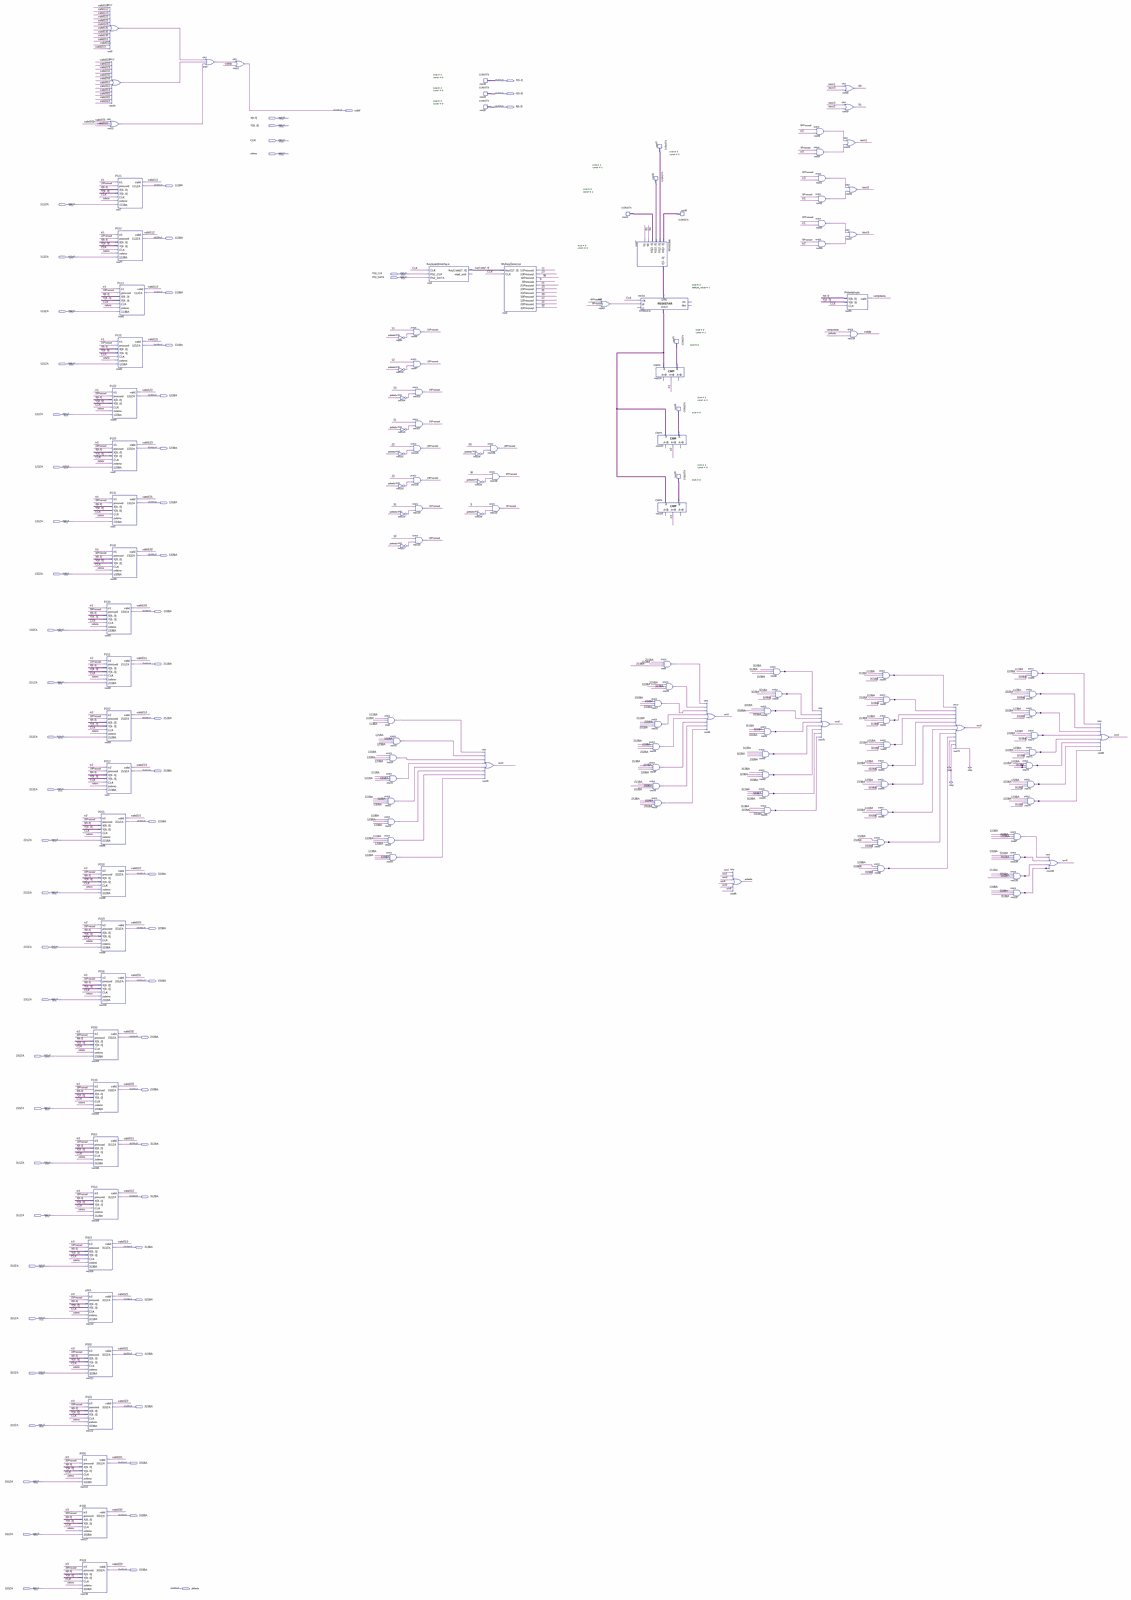
[diagram p0: schematic sheet, whole]
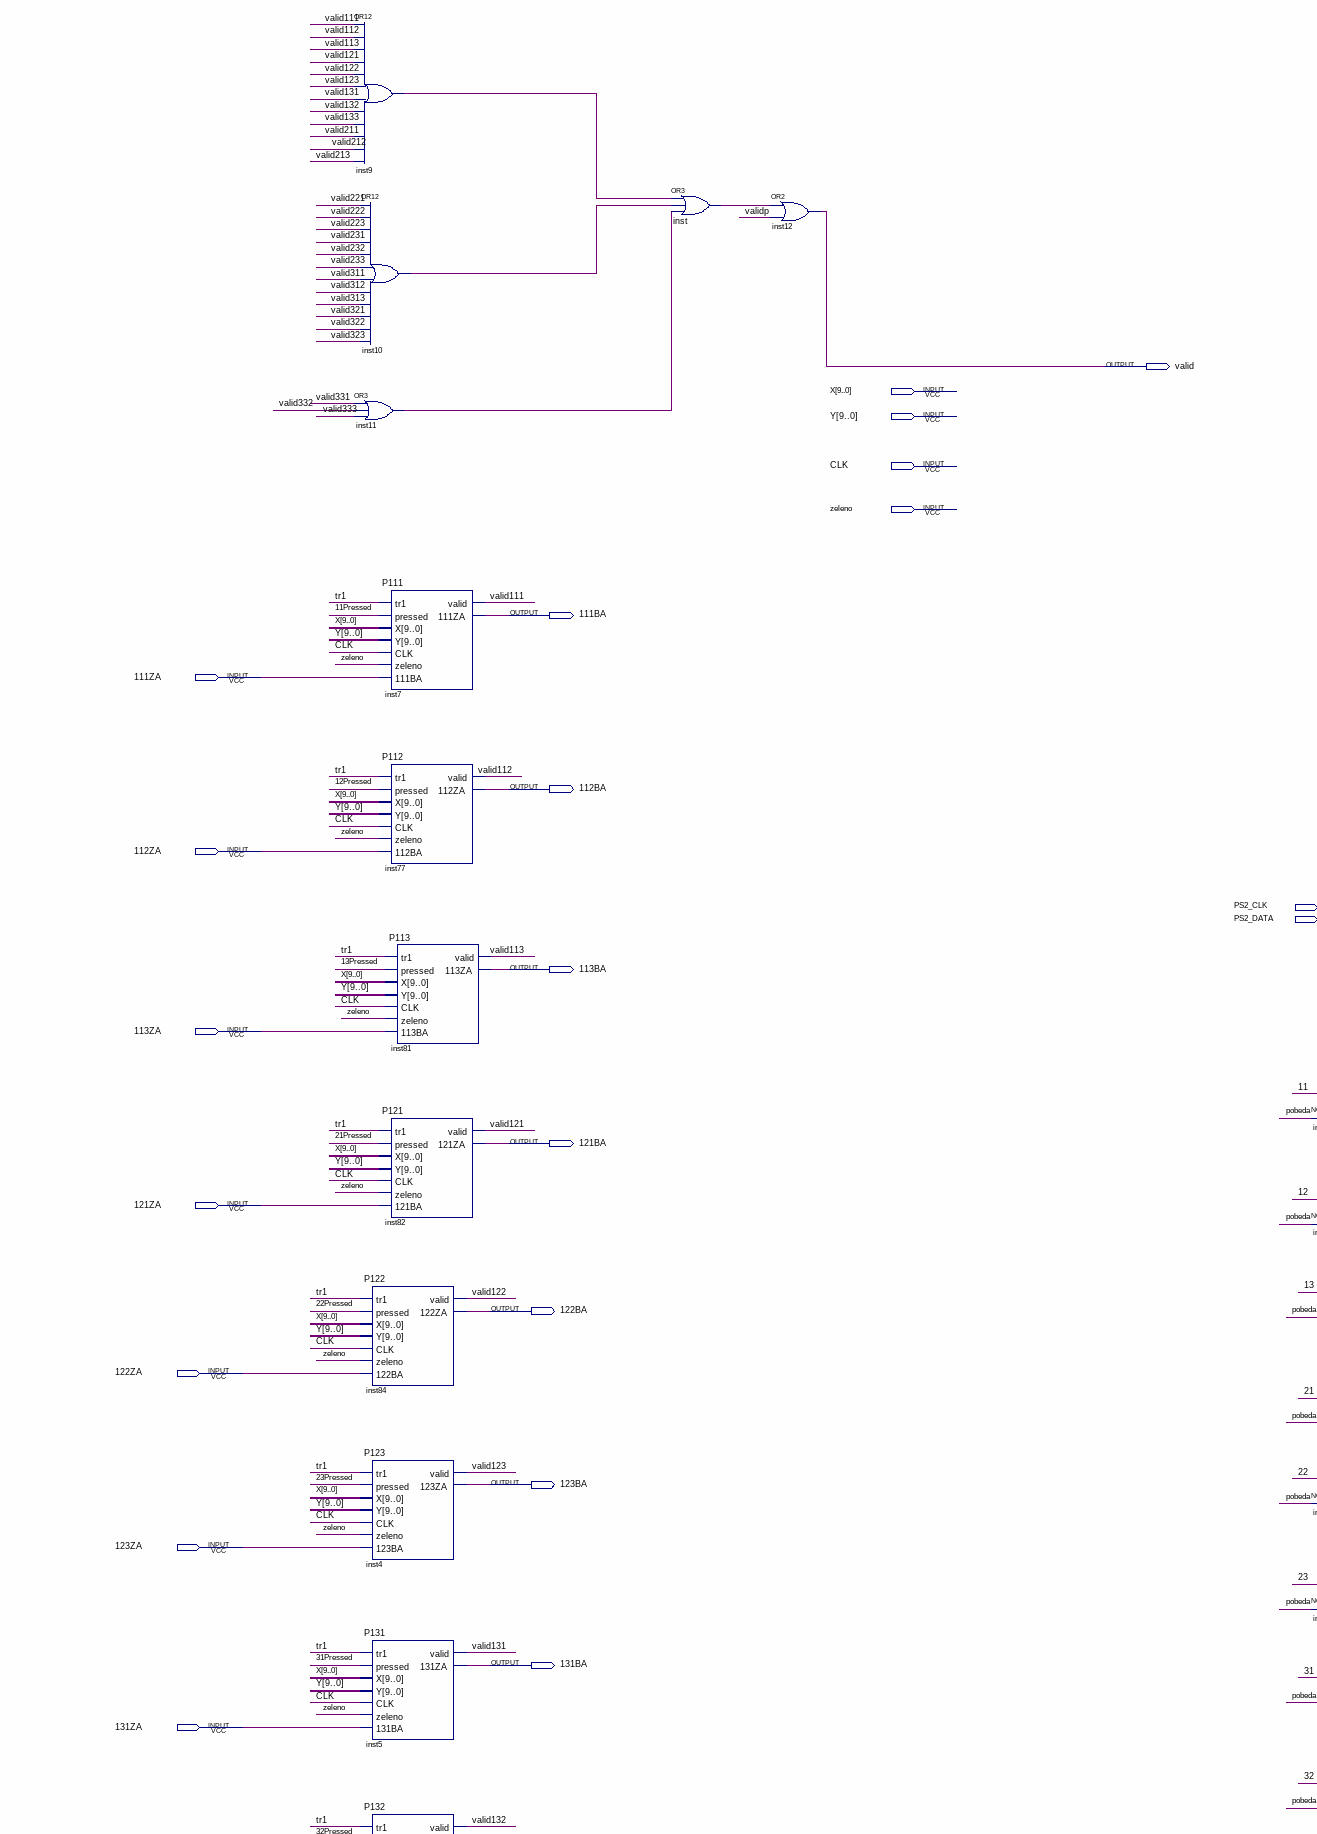
[diagram p1: schematic sheet, upper left part]
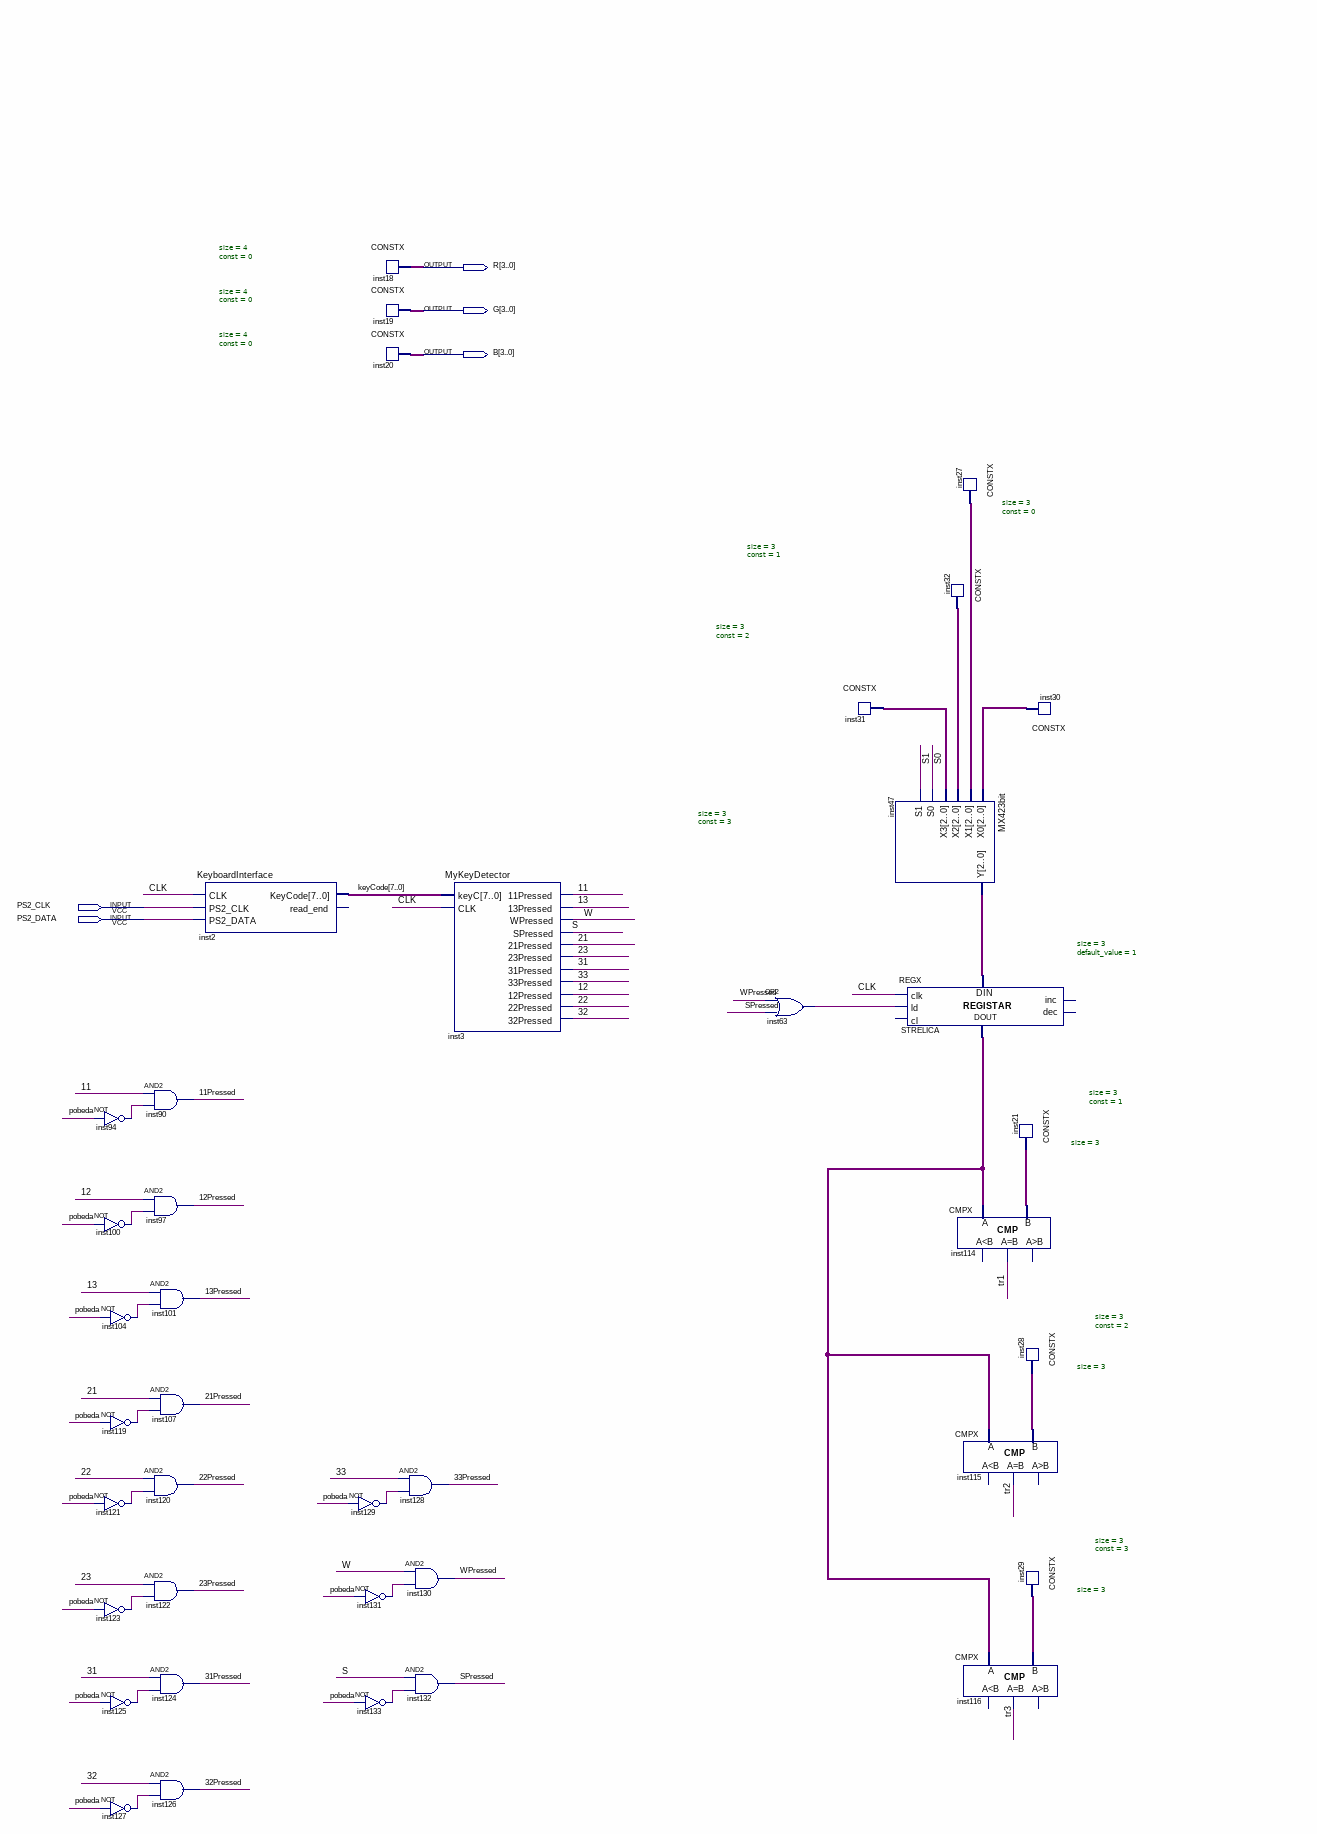
[diagram p2: schematic sheet, upper centre part]
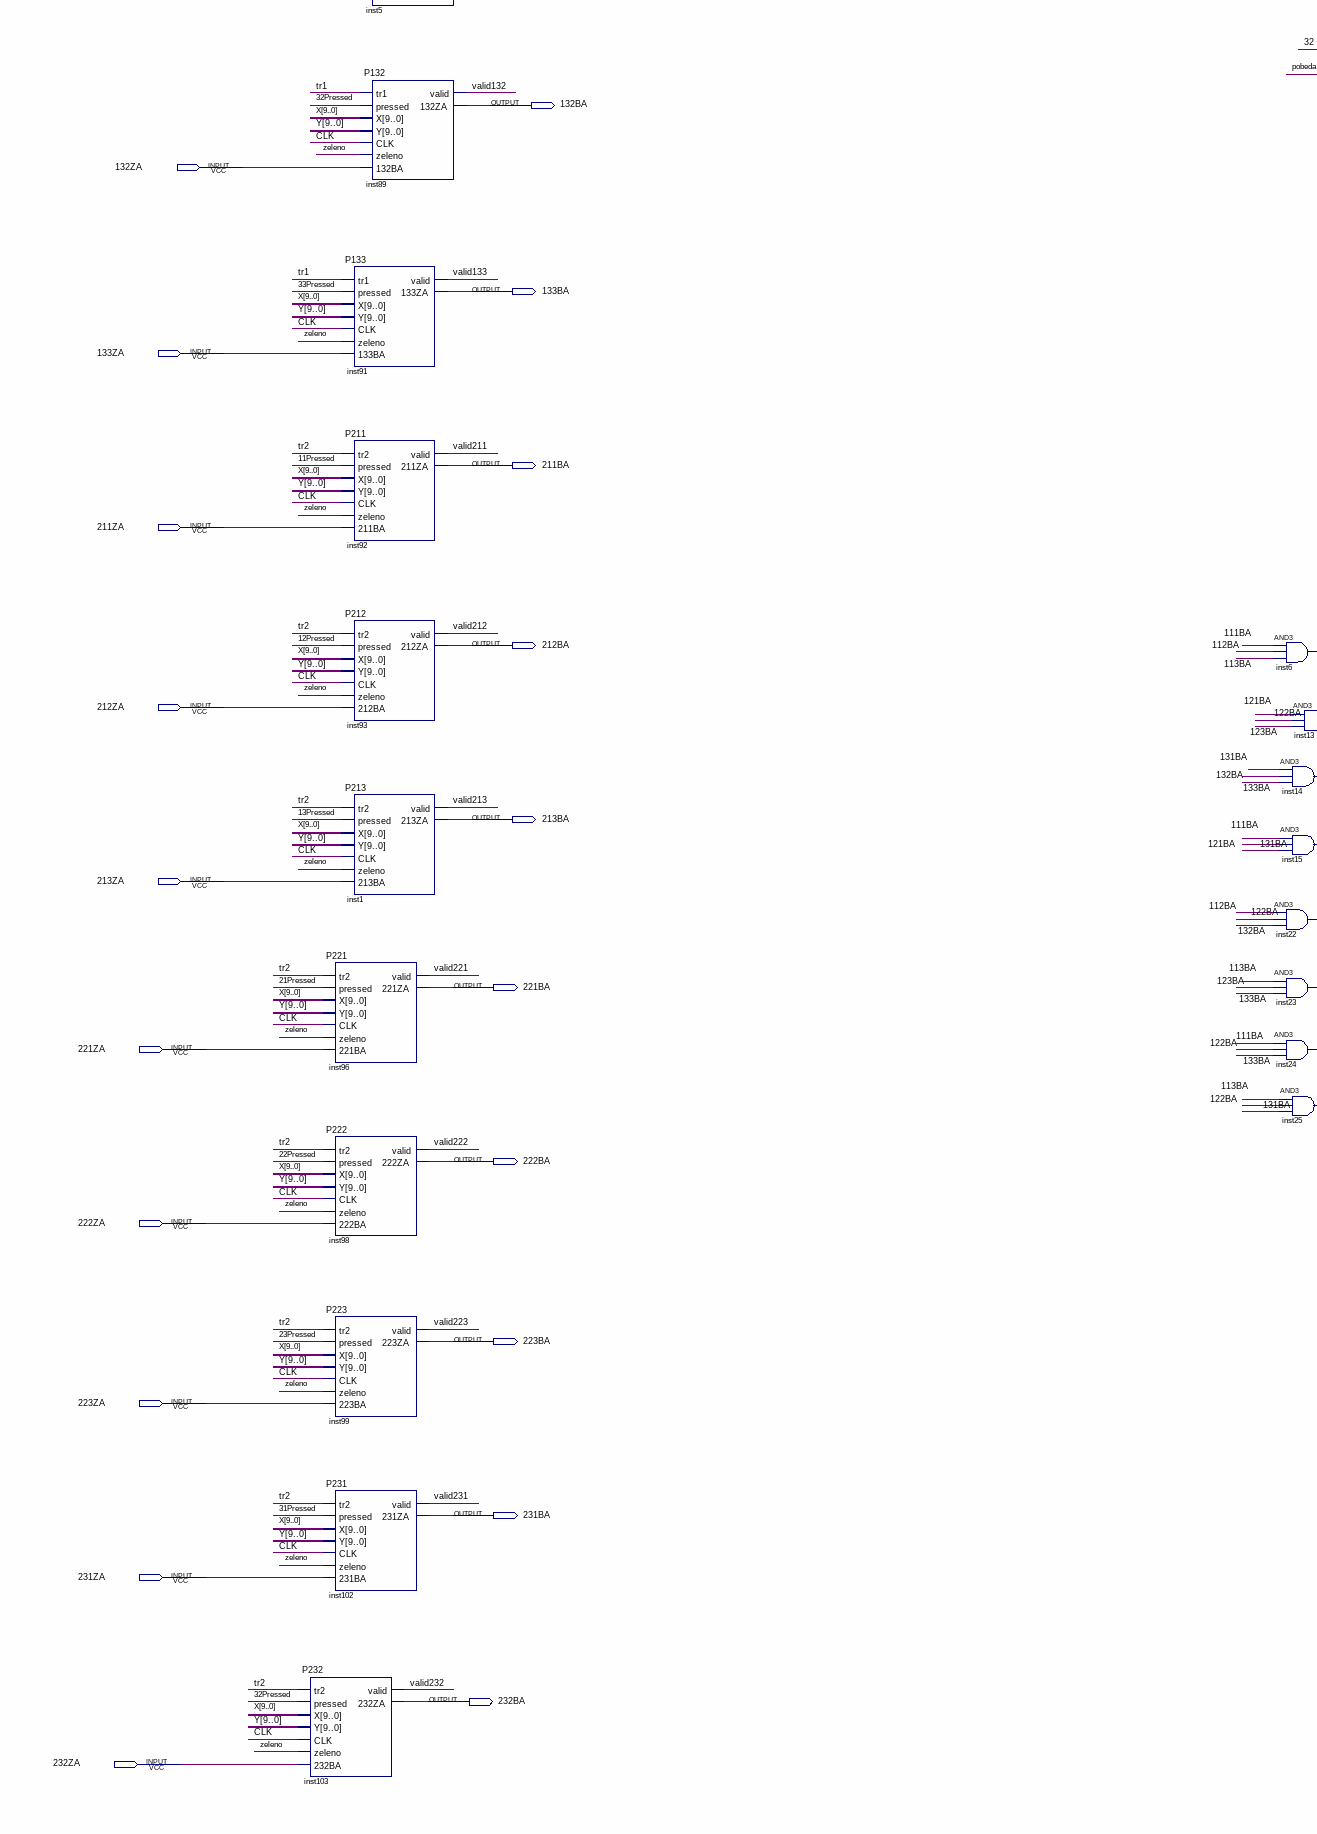
[diagram p3: schematic sheet, middle left part]
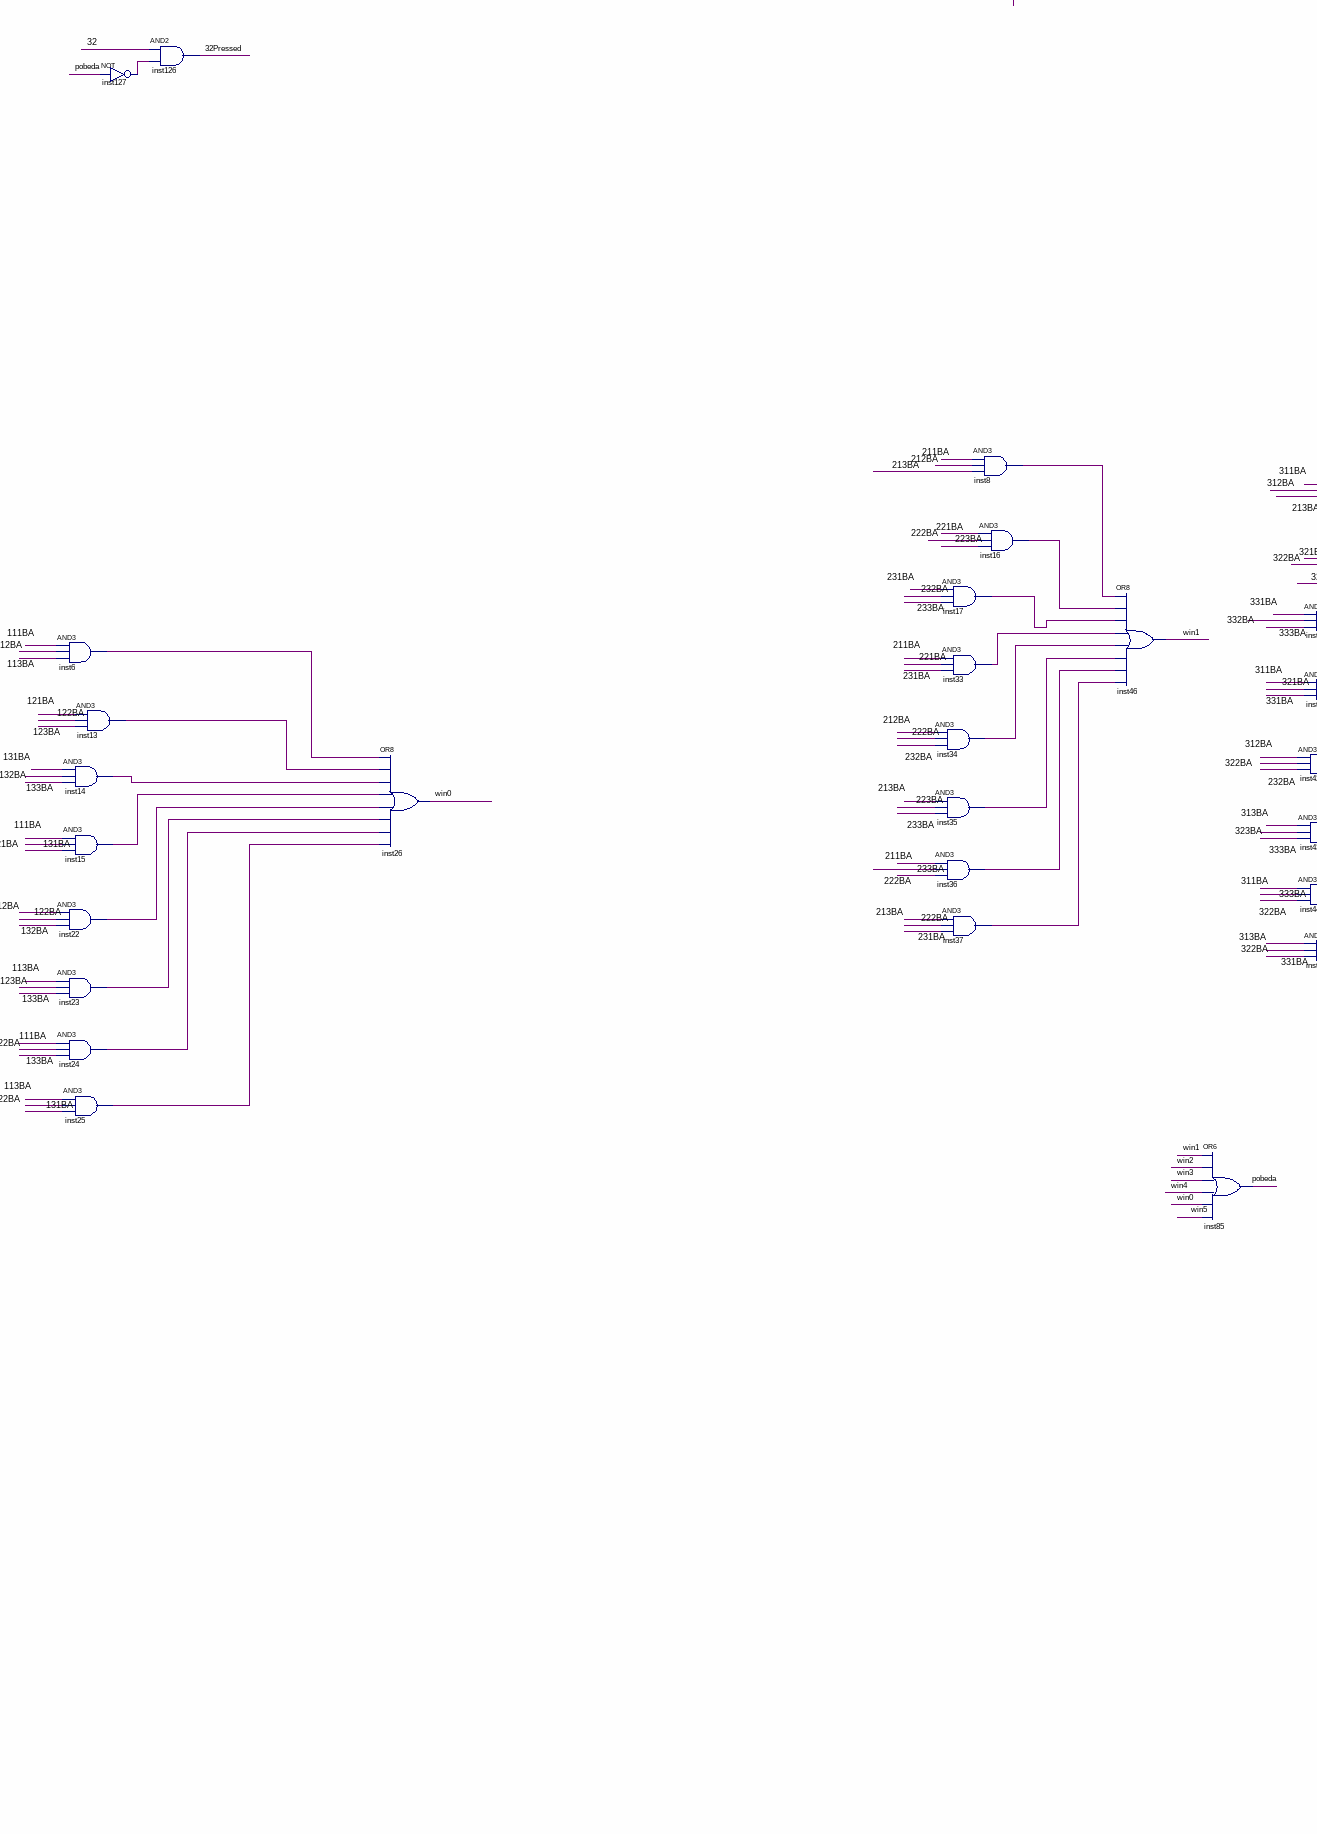
[diagram p4: schematic sheet, middle centre part]
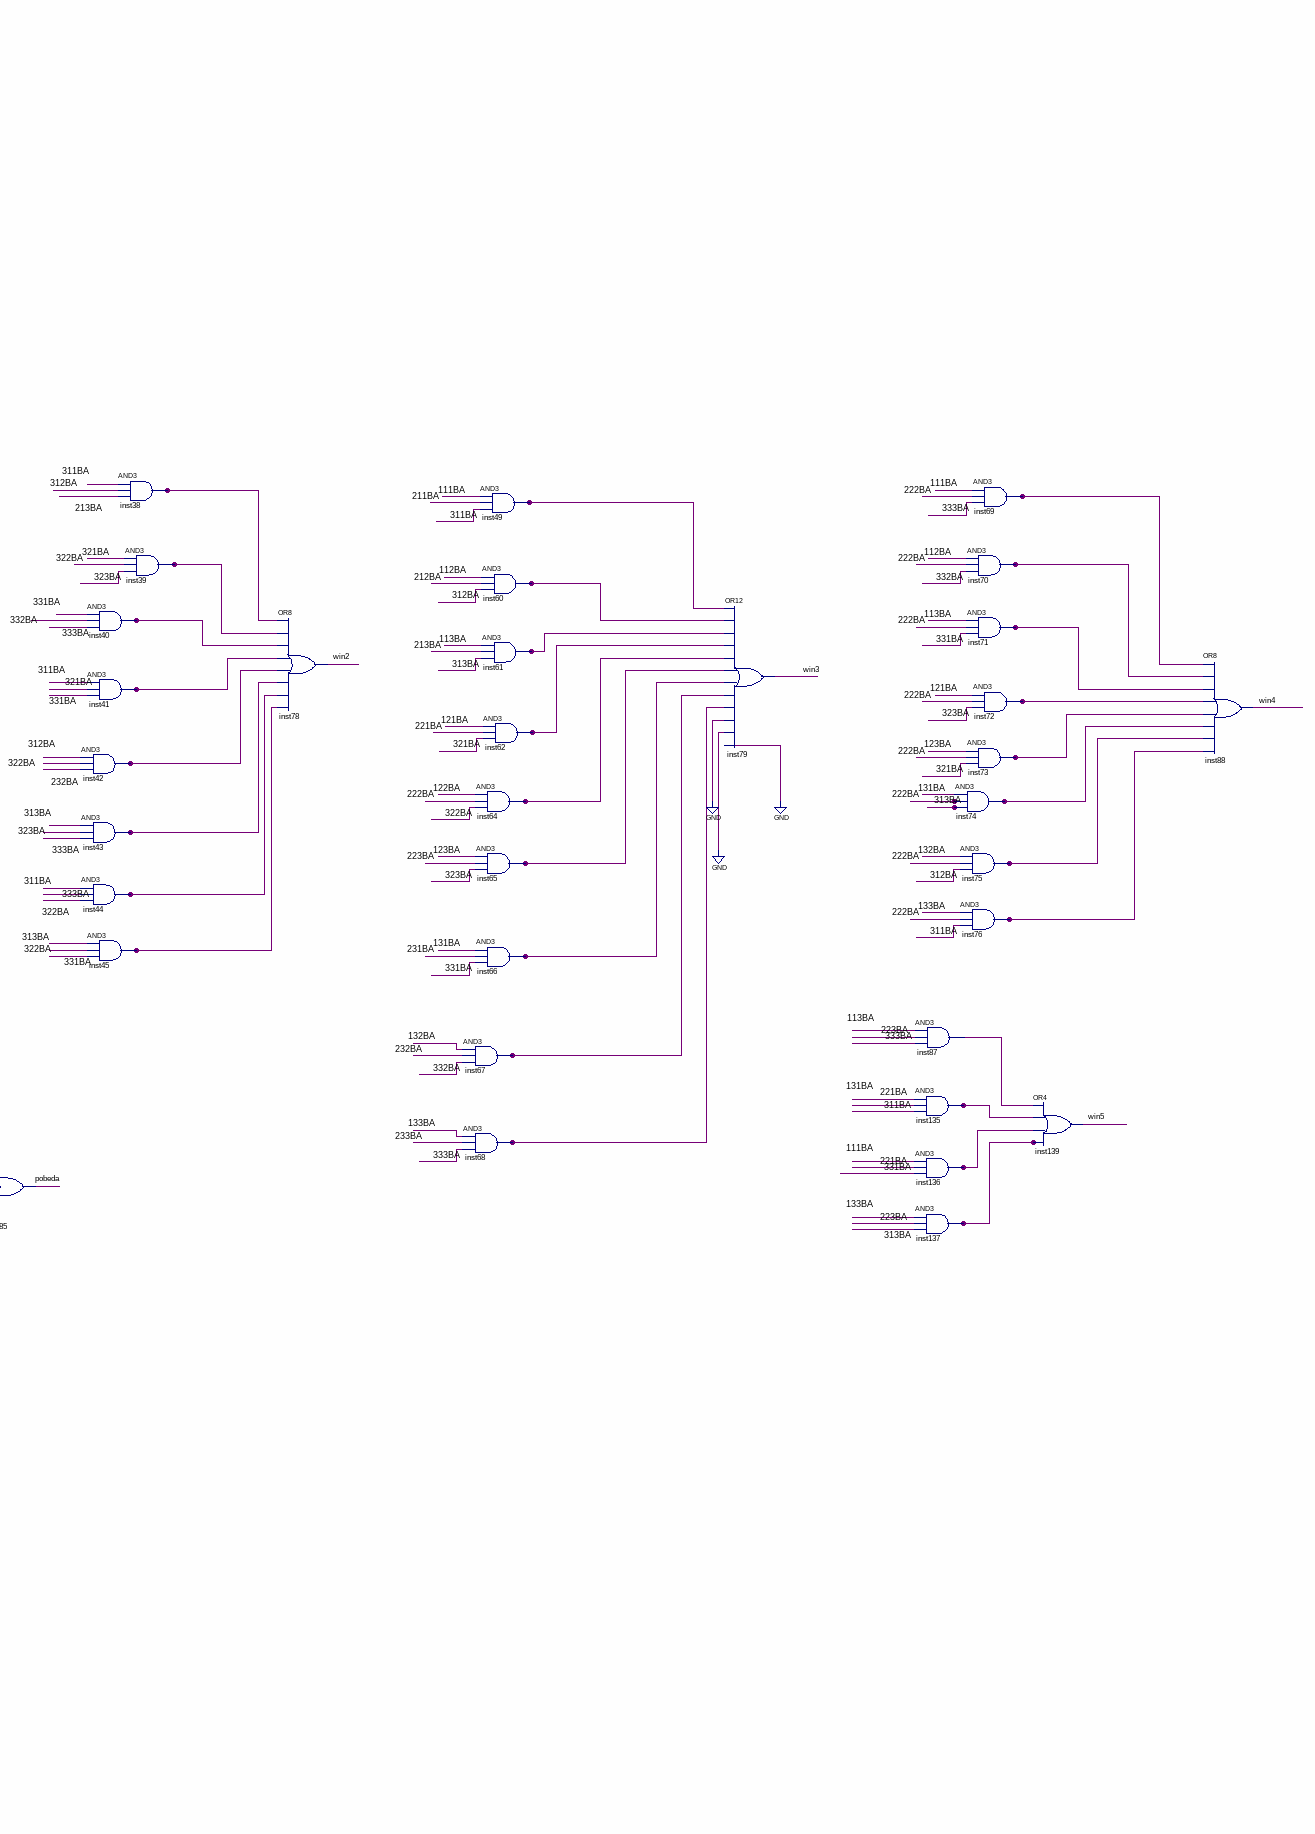
[diagram p5: schematic sheet, middle right part]
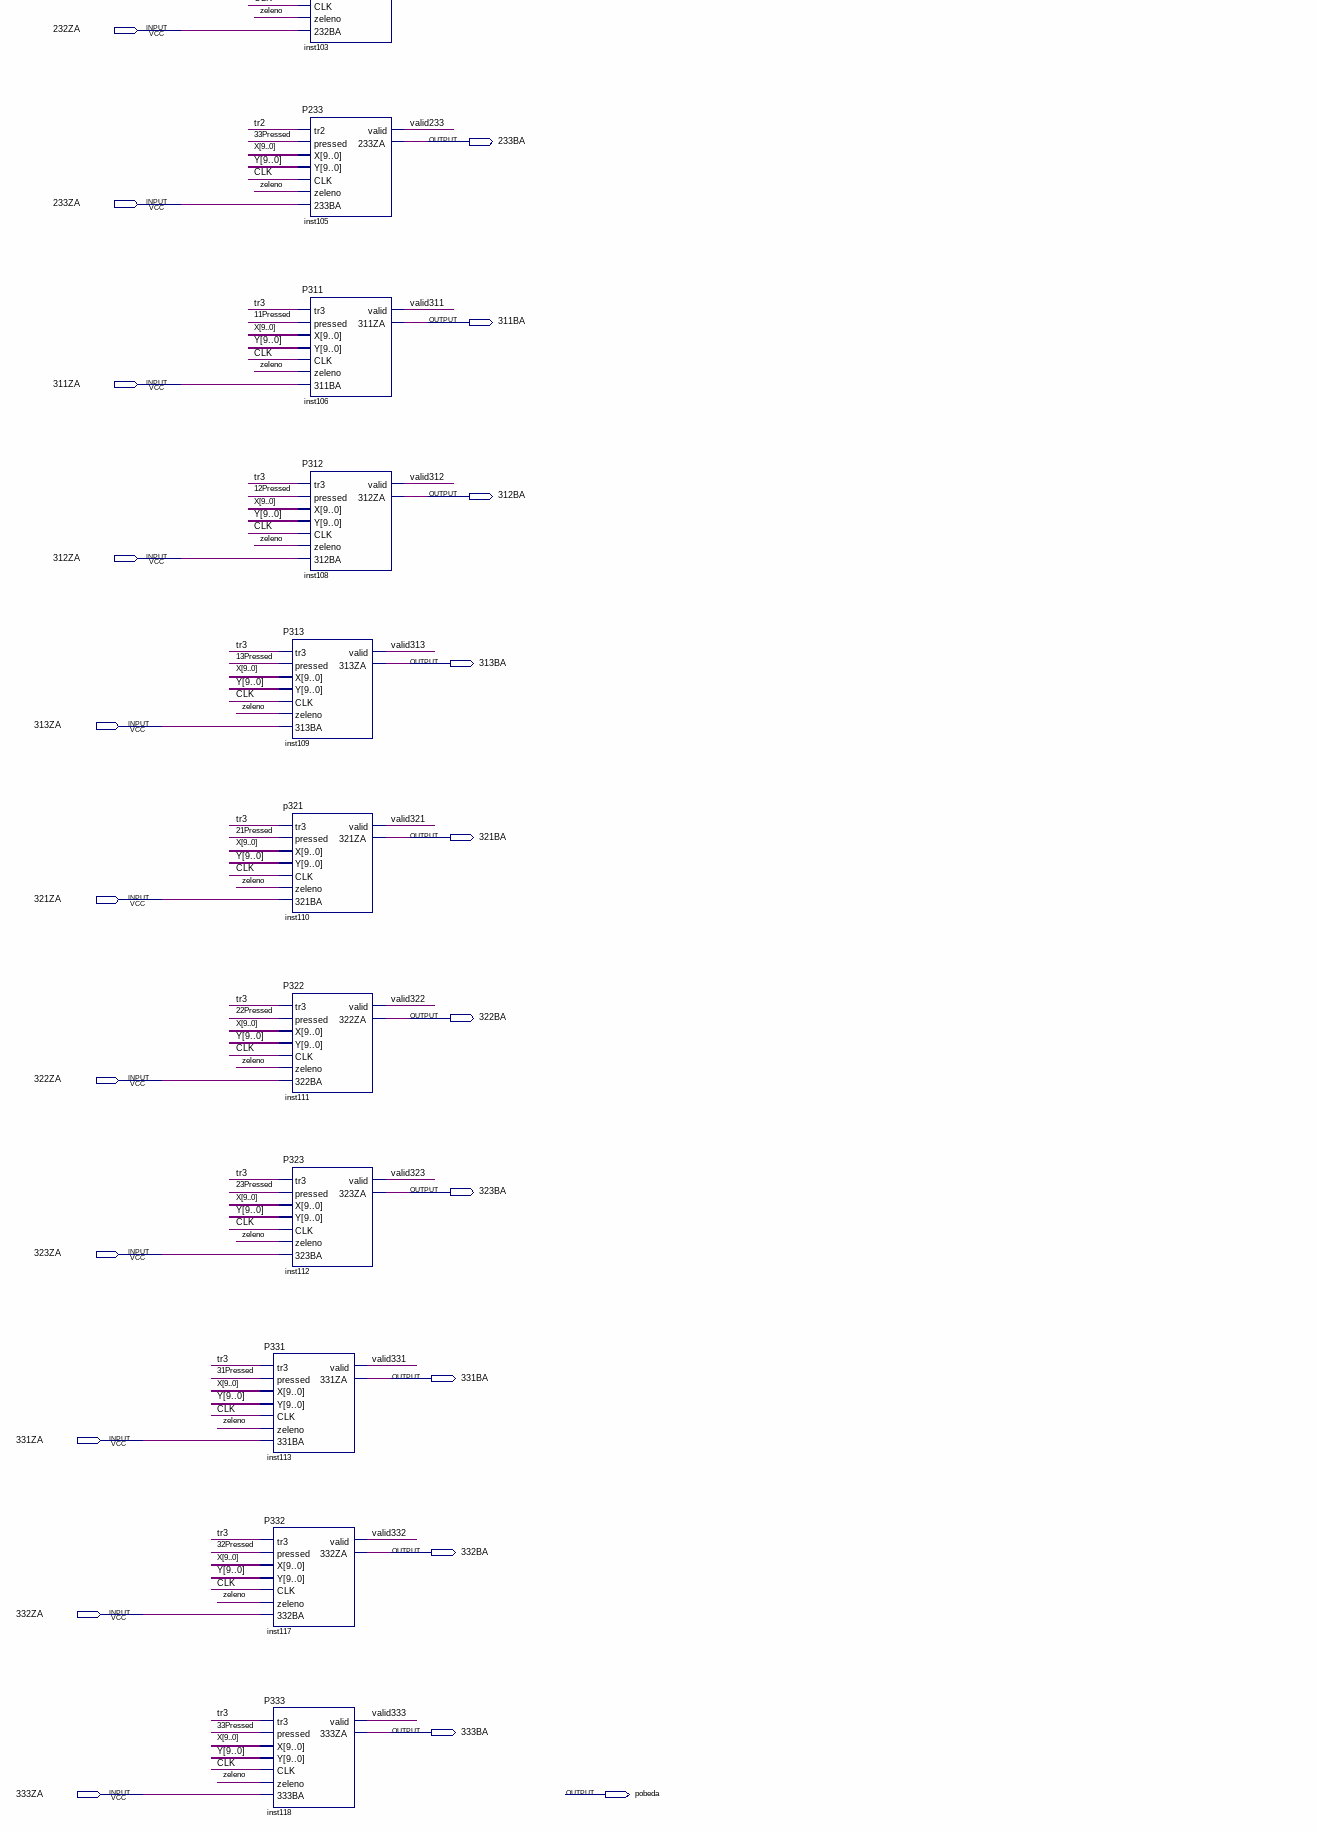
[diagram p6: schematic sheet, lower left part]
// Quartus schematic Layer3.bdf as structural Verilog: 137 symbols, 65 pins
module Layer3 (
  input  [9:0] X,
  input  [9:0] Y,
  input  CLK,
  input  zeleno,
  input  \111ZA ,
  input  \112ZA ,
  input  PS2_CLK,
  input  PS2_DATA,
  input  \113ZA ,
  input  \121ZA ,
  input  \122ZA ,
  input  \123ZA ,
  input  \131ZA ,
  input  \132ZA ,
  input  \133ZA ,
  input  \211ZA ,
  input  \212ZA ,
  input  \213ZA ,
  input  \221ZA ,
  input  \222ZA ,
  input  \223ZA ,
  input  \231ZA ,
  input  \232ZA ,
  input  \233ZA ,
  input  \311ZA ,
  input  \312ZA ,
  input  \313ZA ,
  input  \321ZA ,
  input  \322ZA ,
  input  \323ZA ,
  input  \331ZA ,
  input  \332ZA ,
  input  \333ZA ,
  output [3:0] R,
  output [3:0] G,
  output [3:0] B,
  output valid,
  output \111BA ,
  output \112BA ,
  output \113BA ,
  output \121BA ,
  output \122BA ,
  output \123BA ,
  output \131BA ,
  output \132BA ,
  output \133BA ,
  output \211BA ,
  output \212BA ,
  output \213BA ,
  output \221BA ,
  output \222BA ,
  output \223BA ,
  output \231BA ,
  output \232BA ,
  output \233BA ,
  output \311BA ,
  output \312BA ,
  output \313BA ,
  output \321BA ,
  output \322BA ,
  output \323BA ,
  output \331BA ,
  output \332BA ,
  output \333BA ,
  output pobeda
);

  wire \11 , \11Pressed , \12 , \12Pressed , \13 , \13Pressed , \21 , \21Pressed , \22 , \22Pressed , \23 ,
       \23Pressed , \31 , \31Pressed , \32 , \32Pressed , \33 , \33Pressed , inst6_out, inst8_out, inst9_out,
       inst10_out, inst11_out, inst13_out, inst14_out, inst15_out, inst16_out, inst17_out, inst22_out,
       inst23_out, inst24_out, inst25_out, inst33_out, inst34_out, inst35_out, inst36_out, inst37_out,
       inst38_out, inst39_out, inst40_out, inst41_out, inst42_out, inst43_out, inst44_out, inst45_out,
       inst48_out, inst49_out, inst50_out, inst51_out, inst52_out, inst53_out, inst54_out, inst60_out,
       inst61_out, inst62_out, inst63_out, inst64_out, inst65_out, inst66_out, inst67_out, inst68_out,
       inst69_out, inst70_out, inst71_out, inst72_out, inst73_out, inst74_out, inst75_out, inst76_out,
       inst87_out, inst94_out, inst100_out, inst104_out, inst119_out, inst121_out, inst123_out, inst125_out,
       inst127_out, inst129_out, inst131_out, inst133_out, inst135_out, inst136_out, inst137_out, inst_out,
       next1, next2, next3, S, S0, S1, SPressed, tr1, tr2, tr3, valid111, valid112, valid113, valid121,
       valid122, valid123, valid131, valid132, valid133, valid211, valid212, valid213, valid221, valid222,
       valid223, valid231, valid232, valid233, valid311, valid312, valid313, valid321, valid322, valid323,
       valid331, valid332, valid333, validp, validpobeda, W, win0, win1, win2, win3, win4, win5, WPressed;
  wire [2:0] inst21_data, inst27_data, inst28_data, inst29_data, inst30_data, inst31_data, inst32_data,
       inst47_y, STRELICA_data_out;
  wire [7:0] keyCode;

  P331 inst113 (
    .tr3(tr3), .pressed(\31Pressed ), .X(X), .Y(Y), .CLK(CLK), .zeleno(zeleno), .\331BA (\331ZA ),
    .valid(valid331), .\331ZA (\331BA ));
  P332 inst117 (
    .tr3(tr3), .pressed(\32Pressed ), .X(X), .Y(Y), .CLK(CLK), .zeleno(zeleno), .\332BA (\332ZA ),
    .valid(valid332), .\332ZA (\332BA ));
  P333 inst118 (
    .tr3(tr3), .pressed(\33Pressed ), .X(X), .Y(Y), .CLK(CLK), .zeleno(zeleno), .\333BA (\333ZA ),
    .valid(valid333), .\333ZA (\333BA ));
  P232 inst103 (
    .tr2(tr2), .pressed(\32Pressed ), .X(X), .Y(Y), .CLK(CLK), .zeleno(zeleno), .\232BA (\232ZA ),
    .valid(valid232), .\232ZA (\232BA ));
  P233 inst105 (
    .tr2(tr2), .pressed(\33Pressed ), .X(X), .Y(Y), .CLK(CLK), .zeleno(zeleno), .\233BA (\233ZA ),
    .valid(valid233), .\233ZA (\233BA ));
  P311 inst106 (
    .tr3(tr3), .pressed(\11Pressed ), .X(X), .Y(Y), .CLK(CLK), .zeleno(zeleno), .\311BA (\311ZA ),
    .valid(valid311), .\311ZA (\311BA ));
  P312 inst108 (
    .tr3(tr3), .pressed(\12Pressed ), .X(X), .Y(Y), .CLK(CLK), .zeleno(zeleno), .\312BA (\312ZA ),
    .valid(valid312), .\312ZA (\312BA ));
  P313 inst109 (
    .tr3(tr3), .pressed(\13Pressed ), .X(X), .Y(Y), .CLK(CLK), .zeleno(zeleno), .\313BA (\313ZA ),
    .valid(valid313), .\313ZA (\313BA ));
  p321 inst110 (
    .tr3(tr3), .pressed(\21Pressed ), .X(X), .Y(Y), .CLK(CLK), .zeleno(zeleno), .\321BA (\321ZA ),
    .valid(valid321), .\321ZA (\321BA ));
  P322 inst111 (
    .tr3(tr3), .pressed(\22Pressed ), .X(X), .Y(Y), .CLK(CLK), .zeleno(zeleno), .\322BA (\322ZA ),
    .valid(valid322), .\322ZA (\322BA ));
  P323 inst112 (
    .tr3(tr3), .pressed(\23Pressed ), .X(X), .Y(Y), .CLK(CLK), .zeleno(zeleno), .\323BA (\323ZA ),
    .valid(valid323), .\323ZA (\323BA ));
  or inst9 (inst9_out, valid111, valid112, valid113, valid121, valid122, valid123, valid131, valid132, valid133, valid211, valid212, valid213);
  or inst10 (inst10_out, valid221, valid222, valid223, valid231, valid232, valid233, valid311, valid312, valid313, valid321, valid322, valid323);
  or inst11 (inst11_out, valid331, valid332, valid333);
  P122 inst84 (
    .tr1(tr1), .pressed(\22Pressed ), .X(X), .Y(Y), .CLK(CLK), .zeleno(zeleno), .\122BA (\122ZA ),
    .valid(valid122), .\122ZA (\122BA ));
  P123 inst4 (
    .tr1(tr1), .pressed(\23Pressed ), .X(X), .Y(Y), .CLK(CLK), .zeleno(zeleno), .\123BA (\123ZA ),
    .valid(valid123), .\123ZA (\123BA ));
  P131 inst5 (
    .tr1(tr1), .pressed(\31Pressed ), .X(X), .Y(Y), .CLK(CLK), .zeleno(zeleno), .\131BA (\131ZA ),
    .valid(valid131), .\131ZA (\131BA ));
  P132 inst89 (
    .tr1(tr1), .pressed(\32Pressed ), .X(X), .Y(Y), .CLK(CLK), .zeleno(zeleno), .\132BA (\132ZA ),
    .valid(valid132), .\132ZA (\132BA ));
  P133 inst91 (
    .tr1(tr1), .pressed(\33Pressed ), .X(X), .Y(Y), .CLK(CLK), .zeleno(zeleno), .\133BA (\133ZA ),
    .valid(valid133), .\133ZA (\133BA ));
  P211 inst92 (
    .tr2(tr2), .pressed(\11Pressed ), .X(X), .Y(Y), .CLK(CLK), .zeleno(zeleno), .\211BA (\211ZA ),
    .valid(valid211), .\211ZA (\211BA ));
  P212 inst93 (
    .tr2(tr2), .pressed(\12Pressed ), .X(X), .Y(Y), .CLK(CLK), .zeleno(zeleno), .\212BA (\212ZA ),
    .valid(valid212), .\212ZA (\212BA ));
  P213 inst1 (
    .tr2(tr2), .pressed(\13Pressed ), .X(X), .Y(Y), .CLK(CLK), .zeleno(zeleno), .\213BA (\213ZA ),
    .valid(valid213), .\213ZA (\213BA ));
  P221 inst96 (
    .tr2(tr2), .pressed(\21Pressed ), .X(X), .Y(Y), .CLK(CLK), .zeleno(zeleno), .\221BA (\221ZA ),
    .valid(valid221), .\221ZA (\221BA ));
  P222 inst98 (
    .tr2(tr2), .pressed(\22Pressed ), .X(X), .Y(Y), .CLK(CLK), .zeleno(zeleno), .\222BA (\222ZA ),
    .valid(valid222), .\222ZA (\222BA ));
  P223 inst99 (
    .tr2(tr2), .pressed(\23Pressed ), .X(X), .Y(Y), .CLK(CLK), .zeleno(zeleno), .\223BA (\223ZA ),
    .valid(valid223), .\223ZA (\223BA ));
  P231 inst102 (
    .tr2(tr2), .pressed(\31Pressed ), .X(X), .Y(Y), .CLK(CLK), .zeleno(zeleno), .\231BA (\231ZA ),
    .valid(valid231), .\231ZA (\231BA ));
  P111 inst7 (
    .tr1(tr1), .pressed(\11Pressed ), .X(X), .Y(Y), .CLK(CLK), .zeleno(zeleno), .\111BA (\111ZA ),
    .valid(valid111), .\111ZA (\111BA ));
  P112 inst77 (
    .tr1(tr1), .pressed(\12Pressed ), .X(X), .Y(Y), .CLK(CLK), .zeleno(zeleno), .\112BA (\112ZA ),
    .valid(valid112), .\112ZA (\112BA ));
  P113 inst81 (
    .tr1(tr1), .pressed(\13Pressed ), .X(X), .Y(Y), .CLK(CLK), .zeleno(zeleno), .\113BA (\113ZA ),
    .valid(valid113), .\113ZA (\113BA ));
  P121 inst82 (
    .tr1(tr1), .pressed(\21Pressed ), .X(X), .Y(Y), .CLK(CLK), .zeleno(zeleno), .\121BA (\121ZA ),
    .valid(valid121), .\121ZA (\121BA ));
  or inst (inst_out, inst9_out, inst10_out, inst11_out);
  or inst12 (valid, inst_out, validp);
  and inst6 (inst6_out, \111BA , \112BA , \113BA );
  and inst13 (inst13_out, \121BA , \122BA , \123BA );
  and inst14 (inst14_out, \131BA , \132BA , \133BA );
  and inst15 (inst15_out, \111BA , \121BA , \131BA );
  and inst22 (inst22_out, \112BA , \122BA , \132BA );
  and inst23 (inst23_out, \113BA , \123BA , \133BA );
  and inst24 (inst24_out, \111BA , \122BA , \133BA );
  and inst25 (inst25_out, \113BA , \122BA , \131BA );
  not inst94 (inst94_out, pobeda);
  not inst100 (inst100_out, pobeda);
  not inst104 (inst104_out, pobeda);
  not inst119 (inst119_out, pobeda);
  not inst121 (inst121_out, pobeda);
  not inst123 (inst123_out, pobeda);
  not inst125 (inst125_out, pobeda);
  not inst127 (inst127_out, pobeda);
  and inst90 (\11Pressed , \11 , inst94_out);
  and inst97 (\12Pressed , \12 , inst100_out);
  and inst101 (\13Pressed , \13 , inst104_out);
  and inst107 (\21Pressed , \21 , inst119_out);
  and inst120 (\22Pressed , \22 , inst121_out);
  and inst122 (\23Pressed , \23 , inst123_out);
  and inst124 (\31Pressed , \31 , inst125_out);
  and inst126 (\32Pressed , \32 , inst127_out);
  KeyboardInterface inst2 (.CLK(CLK), .PS2_CLK(PS2_CLK), .PS2_DATA(PS2_DATA), .KeyCode(keyCode));  // open: read_end
  CONSTX #(.size(4), .\const (0)) inst18 (.data(R));
  CONSTX #(.size(4), .\const (0)) inst19 (.data(G));
  CONSTX #(.size(4), .\const (0)) inst20 (.data(B));
  not inst129 (inst129_out, pobeda);
  not inst131 (inst131_out, pobeda);
  not inst133 (inst133_out, pobeda);
  or inst26 (win0, inst6_out, inst13_out, inst14_out, inst15_out, inst22_out, inst23_out, inst24_out, inst25_out);
  and inst128 (\33Pressed , \33 , inst129_out);
  and inst130 (WPressed, W, inst131_out);
  and inst132 (SPressed, S, inst133_out);
  MyKeyDetector inst3 (
    .keyC(keyCode), .CLK(CLK), .\11Pressed (\11 ), .\13Pressed (\13 ), .WPressed(W), .SPressed(S),
    .\21Pressed (\21 ), .\23Pressed (\23 ), .\31Pressed (\31 ), .\33Pressed (\33 ), .\12Pressed (\12 ),
    .\22Pressed (\22 ), .\32Pressed (\32 ));
  or inst63 (inst63_out, WPressed, SPressed);
  CONSTX #(.size(3), .\const (3)) inst31 (.data(inst31_data));
  MX423bit inst47 (
    .X0(inst30_data), .X1(inst27_data), .X2(inst32_data), .X3(inst31_data), .S0(S0), .S1(S1), .Y(inst47_y));
  REGX #(.size(3), .default_value(1)) STRELICA (
    .clk(CLK), .ld(inst63_out), .data_in(inst47_y), .data_out(STRELICA_data_out));  // open: cl, inc, dec
  and inst34 (inst34_out, \212BA , \222BA , \232BA );
  and inst35 (inst35_out, \213BA , \223BA , \233BA );
  and inst36 (inst36_out, \211BA , \222BA , \233BA );
  CONSTX #(.size(3), .\const (1)) inst27 (.data(inst27_data));
  CONSTX #(.size(3), .\const (2)) inst32 (.data(inst32_data));
  CMPX #(.size(3)) inst114 (.A(STRELICA_data_out), .B(inst21_data), .eq(tr1));  // open: ls, gr
  CMPX #(.size(3)) inst115 (.A(STRELICA_data_out), .B(inst28_data), .eq(tr2));  // open: ls, gr
  CMPX #(.size(3)) inst116 (.A(STRELICA_data_out), .B(inst29_data), .eq(tr3));  // open: ls, gr
  and inst8 (inst8_out, \211BA , \212BA , \213BA );
  and inst16 (inst16_out, \221BA , \222BA , \223BA );
  and inst17 (inst17_out, \231BA , \232BA , \233BA );
  and inst33 (inst33_out, \211BA , \221BA , \231BA );
  and inst37 (inst37_out, \213BA , \222BA , \231BA );
  CONSTX #(.size(3), .\const (0)) inst30 (.data(inst30_data));
  CONSTX #(.size(3), .\const (1)) inst21 (.data(inst21_data));
  CONSTX #(.size(3), .\const (2)) inst28 (.data(inst28_data));
  CONSTX #(.size(3), .\const (3)) inst29 (.data(inst29_data));
  or inst46 (win1, inst8_out, inst16_out, inst17_out, inst33_out, inst34_out, inst35_out, inst36_out, inst37_out);
  or inst85 (pobeda, win1, win2, win3, win4, win0, win5);
  and inst38 (inst38_out, \311BA , \312BA , \213BA );
  and inst40 (inst40_out, \331BA , \332BA , \333BA );
  and inst41 (inst41_out, \311BA , \321BA , \331BA );
  and inst42 (inst42_out, \312BA , \322BA , \232BA );
  and inst43 (inst43_out, \313BA , \323BA , \333BA );
  and inst44 (inst44_out, \311BA , \322BA , \333BA );
  and inst45 (inst45_out, \313BA , \322BA , \331BA );
  and inst39 (inst39_out, \321BA , \322BA , \323BA );
  and inst48 (inst48_out, WPressed, tr2);
  and inst50 (inst50_out, SPressed, tr3);
  and inst51 (inst51_out, WPressed, tr3);
  and inst52 (inst52_out, SPressed, tr1);
  and inst53 (inst53_out, WPressed, tr1);
  and inst54 (inst54_out, SPressed, tr2);
  or inst78 (win2, inst38_out, inst39_out, inst40_out, inst41_out, inst42_out, inst43_out, inst44_out, inst45_out);
  or inst58 (S0, next1, next3);
  or inst59 (S1, next3, next2);
  or inst55 (next1, inst48_out, inst50_out);
  PobedaIspis inst95 (.X(X), .Y(Y), .CLK(CLK), .valid(validpobeda));
  or inst56 (next2, inst51_out, inst52_out);
  or inst57 (next3, inst53_out, inst54_out);
  and inst134 (validp, validpobeda, pobeda);
  and inst67 (inst67_out, \132BA , \232BA , \332BA );
  and inst68 (inst68_out, \133BA , \233BA , \333BA );
  and inst49 (inst49_out, \111BA , \211BA , \311BA );
  and inst60 (inst60_out, \112BA , \212BA , \312BA );
  and inst61 (inst61_out, \113BA , \213BA , \313BA );
  and inst62 (inst62_out, \121BA , \221BA , \321BA );
  and inst64 (inst64_out, \122BA , \222BA , \322BA );
  and inst65 (inst65_out, \123BA , \223BA , \323BA );
  and inst66 (inst66_out, \131BA , \231BA , \331BA );
  or inst79 (win3, inst49_out, inst60_out, inst61_out, inst62_out, inst64_out, inst65_out, inst66_out, inst67_out, inst68_out, 1'b0, 1'b0, 1'b0);
  and inst135 (inst135_out, \131BA , \221BA , \311BA );
  and inst136 (inst136_out, \111BA , \221BA , \331BA );
  and inst137 (inst137_out, \133BA , \223BA , \313BA );
  and inst74 (inst74_out, \131BA , \222BA , \313BA );
  and inst75 (inst75_out, \132BA , \222BA , \312BA );
  and inst76 (inst76_out, \133BA , \222BA , \311BA );
  and inst87 (inst87_out, \113BA , \223BA , \333BA );
  and inst69 (inst69_out, \111BA , \222BA , \333BA );
  and inst70 (inst70_out, \112BA , \222BA , \332BA );
  and inst71 (inst71_out, \113BA , \222BA , \331BA );
  and inst72 (inst72_out, \121BA , \222BA , \323BA );
  and inst73 (inst73_out, \123BA , \222BA , \321BA );
  or inst139 (win5, inst87_out, inst135_out, inst136_out, inst137_out);
  or inst88 (win4, inst69_out, inst70_out, inst71_out, inst72_out, inst73_out, inst74_out, inst75_out, inst76_out);
endmodule
